# EAGLE design watering (EAGLE 6.1)
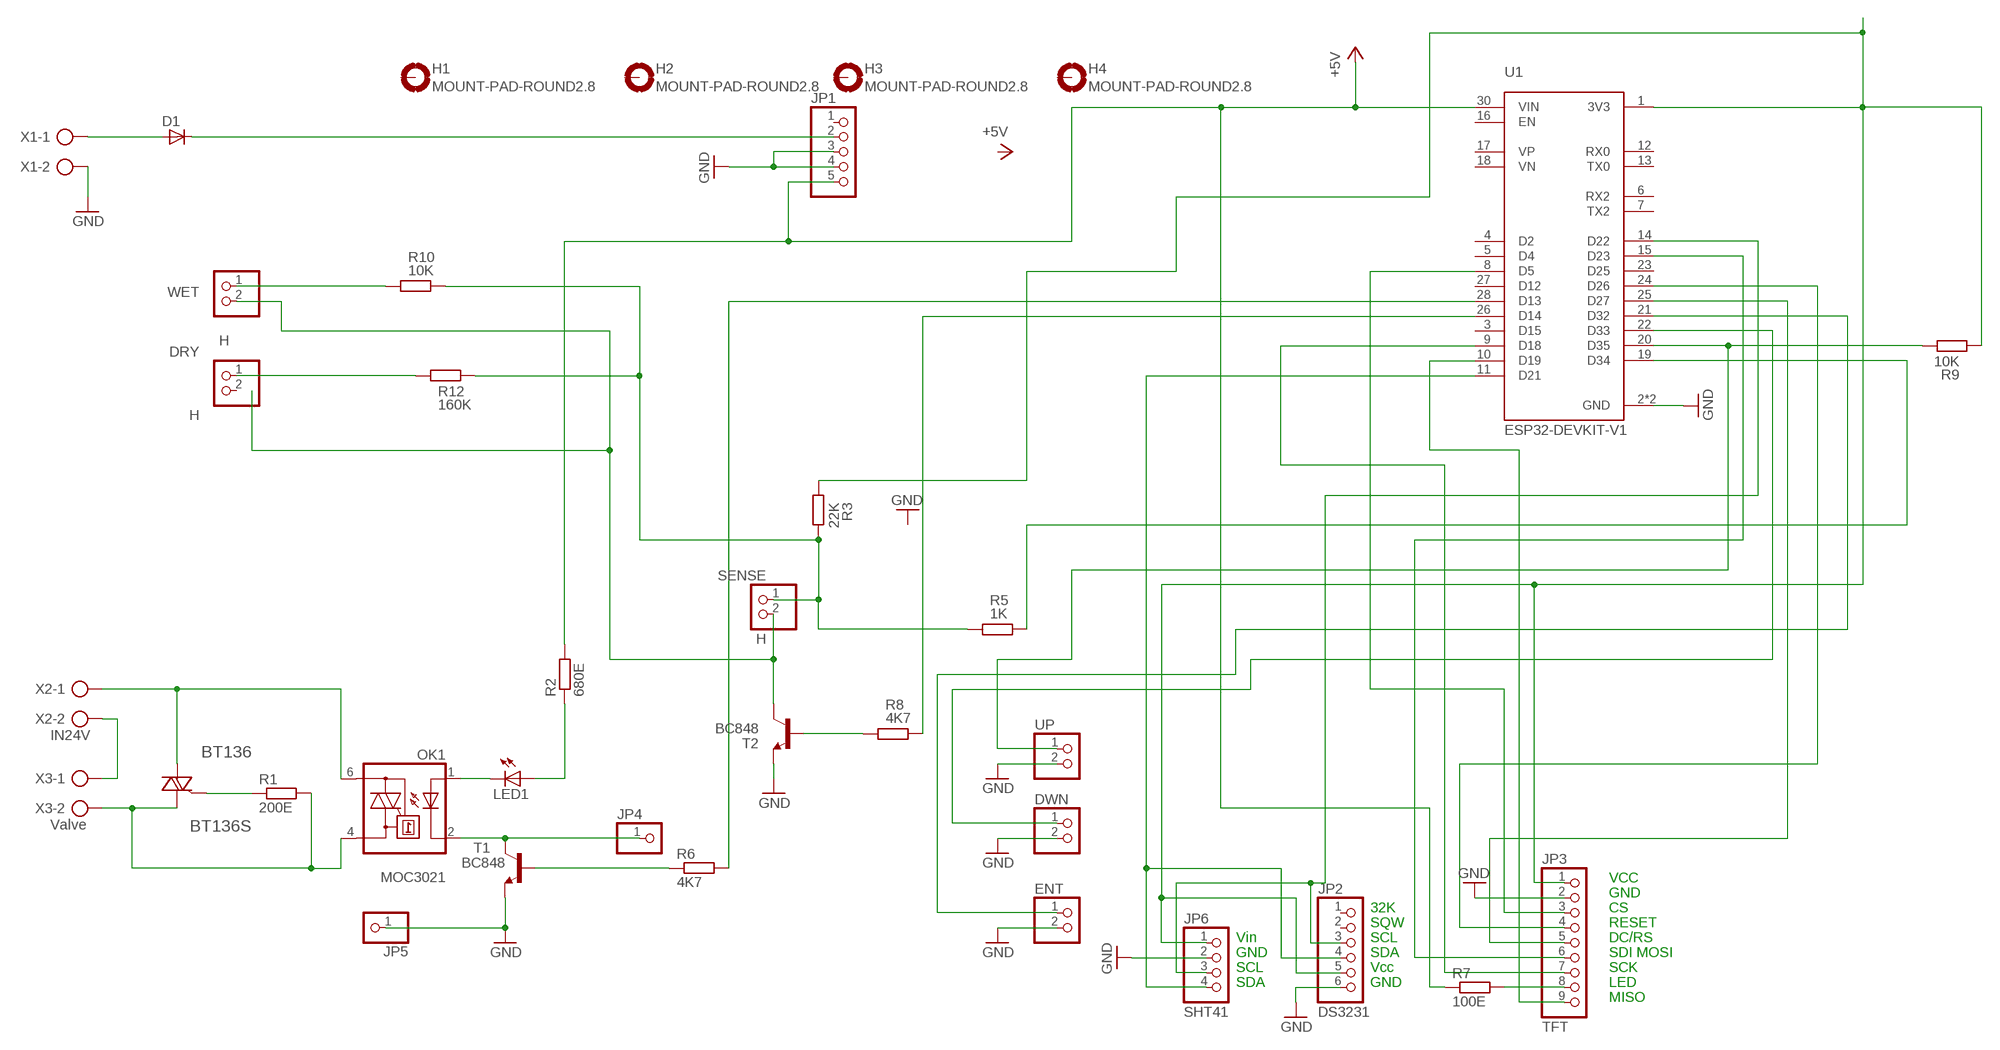
[diagram p0: schematic, sheet 1]

## Parts
BT136  BT136S  T435-600B  [DPAK228P987X240-3N]
D1  D-SOD-80  [SOD80]
DRY  H  PINHD-1X2  [1X02]
DWN  PINHD-1X2  [1X02]
ENT  PINHD-1X2  [1X02]
H1  MOUNT-PAD-ROUND2.8  [2,8-PAD]
H2  MOUNT-PAD-ROUND2.8  [2,8-PAD]
H3  MOUNT-PAD-ROUND2.8  [2,8-PAD]
H4  MOUNT-PAD-ROUND2.8  [2,8-PAD]
JP1  PINHD-1X5  [1X05]
JP2  DS3231  PINHD-1X6  [1X06]
JP3  TFT  PINHD-1X9  [1X09]
JP4  PINHD-1X1  [1X01]
JP5  PINHD-1X1  [1X01]
JP6  SHT41  PINHD-1X4  [1X04]
LED1  LEDCHIPLED_0805  [CHIPLED_0805]
OK1  MOC3021  MOC3031S  [DIL6-SMD]
R1  200E  R-EU_R0603  [R0603]
R2  680E  R-EU_R0603  [R0603]
R3  22K  R-EU_R0603  [R0603]
R5  1K  R-EU_R0603  [R0603]
R6  4K7  R-EU_R0603  [R0603]
R7  100E  R-EU_R0603  [R0603]
R8  4K7  R-EU_R0603  [R0603]
R9  10K  R-EU_R0603  [R0603]
R10  10K  R-EU_R0603  [R0603]
R12  160K  R-EU_R0603  [R0603]
SENSE  H  PINHD-1X2  [1X02]
T1  BC848  [SOT23]
T2  BC848  [SOT23]
U1  ESP32-DEVKIT-V1  [MODULE_ESP32_DEVKIT_V1]
UP  PINHD-1X2  [1X02]
WET  H  PINHD-1X2  [1X02]
X1  AK300/2  [AK300/2]
X2  IN24V  AK300/2  [AK300/2]
X3  Valve  AK300/2  [AK300/2]

## Nets
+5V: JP1.5 R2.2 R7.1 U1.30(VIN)
GND: DWN.2 ENT.2 JP1.3 JP1.4 JP2.6 JP3.2 JP5.1 JP6.2 T1.2(E) T2.2(E) U1.2(GND) U1.29(GND) UP.2 X1.2
N$1: X2.2 X3.1
N$2: BT136.1(A1) OK1.4(A1) R1.2 X3.2
N$3: BT136.3(A2) OK1.6(A2) X2.1
N$4: JP2.5 JP3.1 JP6.1 R3.1 R9.1 U1.1(3V3)
N$5: BT136.2(G) R1.1
N$6: LED1.A R2.1
N$7: JP4.1 OK1.2(C) T1.3(C)
N$8: LED1.C OK1.1(A)
N$9: D1.2(A) X1.1
N$10: D1.1(C) JP1.2
N$11: R3.2 R5.1 R10.2 R12.2 SENSE.1
N$12: DRY.1 R12.1
N$13: R6.1 T1.1(B)
N$14: JP3.8 R7.2
N$15: SENSE.2 T2.3(C) WET.2
N$16: R8.1 T2.1(B)
N$17: R10.1 WET.1
N$18: JP2.3 JP6.3 U1.14(D22)
N$19: JP2.4 JP6.4 U1.11(D21)
N$20: JP3.7 U1.9(D18)
N$21: R8.2 U1.26(D14)
N$22: JP3.6 U1.15(D23)
N$23: R9.2 U1.20(D35) UP.1
N$24: JP3.3 U1.8(D5)
N$25: JP3.5 U1.25(D27)
N$26: JP3.4 U1.24(D26)
N$27: JP3.9 U1.10(D19)
N$28: DWN.1 U1.22(D33)
N$29: ENT.1 U1.21(D32)
N$31: R6.2 U1.28(D13)
N$32: R5.2 U1.19(D34)
Unconnected: DRY.2 H1.B2,8(MOUNT) H2.B2,8(MOUNT) H3.B2,8(MOUNT) H4.B2,8(MOUNT) JP1.1 JP2.1 JP2.2 U1.3(D15) U1.4(D2) U1.5(D4) U1.6(RX2) U1.7(TX2) U1.12(RX0) U1.13(TX0) U1.16(EN) U1.17(VP) U1.18(VN) U1.23(D25) U1.27(D12)

## Notes on the sheet
- VCC
- GND
- 32K | CS
- SQW | RESET
- Vin | SCL | DC/RS
- GND | SDA | SDI MOSI
- SCL | Vcc | SCK
- SDA | GND | LED
- MISO

## Library data of the parts
BT136 = T435-600B:T435-600B: Check availability <https://pricing.snapeda.com/parts/T435-600B/STMicroelectronics/view-part?ref=eda>; AVAILABILITY: In Stock; CHECK_PRICES: https://www.snapeda.com/parts/T435-600B/STMicroelectronics/view-part/?ref=eda; DESCRIPTION: TRIAC Alternistor - Snubberless 600 V 4 A Surface Mount DPAK; MF: STMicroelectronics; MP: T435-600B; PACKAGE: DPAK STMicroelectronics; PRICE: None; SNAPEDA_LINK: https://www.snapeda.com/parts/T435-600B/STMicroelectronics/view-part/?ref=snap
D1 = semicon-smd-ipc:D-: DIODE unfilled
DRY DWN ENT SENSE UP WET = pinhead:PINHD-1X2: PIN HEADER
H1-H4 = holes:MOUNT-PAD-ROUND: MOUNTING PAD, round
JP1 = pinhead:PINHD-1X5: PIN HEADER
JP2 = pinhead:PINHD-1X6: PIN HEADER
JP3 = pinhead:PINHD-1X9: PIN HEADER
JP4 JP5 = pinhead:PINHD-1X1: PIN HEADER
JP6 = pinhead:PINHD-1X4: PIN HEADER
LED1 = led:LED: LED OSRAM: - CHIPLED LG R971, LG N971, LY N971, LG Q971, LY Q971, LO R971, LY R971 LH N974, LH R974 LS Q976, LO Q976, LY Q976 LO Q996 - Hyper CHIPLED LW Q18S LB Q993, LB Q99A, LB R99A - SideLED LS A670, LO A670, LY A670, LG A670, LP A670 LB A673, LV A673, LT A673, LW A673 LH A674 LY A675 LS A676, LA A676, LO A676, LY A676, LW A676 LS A679, LY A679, LG A679 - Hyper Micro SIDELED® LS Y876, LA Y876, LO Y876, LY Y876 LT Y87S - SmartLED LW L88C, LW L88S LB L89C, LB L89S, LG L890 LS L89K, LO L89K, LY L89K LS L896, LA L896, LO L896, LY L896 - TOPLED LS T670, LO T670, LY T670, LG T670, LP T670 LSG T670, LSP T670, LSY T670, LOP T670, LYG T670 LG T671, LOG T671, LSG T671 LB T673, LV T673, LT T673, LW T673 LH T674 LS T676, LA T676, LO T676, LY T676, LB T676, LH T676, LSB T676, LW T676 LB T67C, LV T67C, LT T67C, LS T67K, LO T67K, LY T67K, LW E67C LS E67B, LA E67B, LO E67B, LY E67B, LB E67C, LV E67C, LT E67C LW T67C LS T679, LY T679, LG T679 LS T770, LO T770, LY T770, LG T770, LP T770 LB T773, LV T773, LT T773, LW T773 LH T774 LS E675, LA E675, LY E675, LS T675 LS T776, LA T776, LO T776, LY T776, LB T776 LHGB T686 LT T68C, LB T68C - Hyper Mini TOPLED® LB M676 - Mini TOPLED Santana® LG M470 LS M47K, LO M47K, LY M47K Source: http://www.osram.convergy.de LUXEON: - LUMILED® LXK2-PW12-R00, LXK2-PW12-S00, LXK2-PW14-U00, LXK2-PW14-V00 LXK2-PM12-R00, LXK2-PM12-S00, LXK2-PM14-U00 LXK2-PE12-Q00, LXK2-PE12-R00, LXK2-PE12-S00, LXK2-PE14-T00, LXK2-PE14-U00 LXK2-PB12-K00, LXK2-PB12-L00, LXK2-PB12-M00, LXK2-PB14-N00, LXK2-PB14-P00, LXK2-PB14-Q00 LXK2-PR12-L00, LXK2-PR12-M00, LXK2-PR14-Q00, LXK2-PR14-R00 LXK2-PD12-Q00, LXK2-PD12-R00, LXK2-PD12-S00 LXK2-PH12-R00, LXK2-PH12-S00 LXK2-PL12-P00, LXK2-PL12-Q00, LXK2-PL12-R00 Source: www.luxeon.com KINGBRIGHT: KA-3528ASYC Source: www.kingbright.com
OK1 = optocoupler:MOC30*: 6-Pin DIP Zero-Cross Optoisolators Triac Driver Output (250/400 Volt Peak) Source: http://www.fairchildsemi.com/ds/MO/MOC3043-M.pdf; MF: FAIRCHILD SEMICONDUCTOR; MPN: MOC3031SM; OC_FARNELL: unknown; OC_NEWARK: 34C1335
R1-R3 R5-R10 R12 = rcl:R-EU_: RESISTOR, European symbol
T1 T2 = transistor:BC848: NPN TRANSISTOR
U1 = ESP32-DEVKIT-V1:ESP32-DEVKIT-V1: Check availability <https://pricing.snapeda.com/parts/ESP32-DEVKIT-V1/Do%20it/view-part?ref=eda>; AVAILABILITY: Not in stock; CHECK_PRICES: https://www.snapeda.com/parts/ESP32-DEVKIT-V1/Do+it/view-part/?ref=eda; DESCRIPTION: Dual core, Wi-Fi: 2.4 GHz up to 150 Mbits/s,BLE (Bluetooth Low Energy) and legacy Bluetooth, 32 bits, Up to 240 MHz; MF: Do it; MP: ESP32-DEVKIT-V1; PACKAGE: None; PRICE: None; SNAPEDA_LINK: https://www.snapeda.com/parts/ESP32-DEVKIT-V1/Do+it/view-part/?ref=snap
X1-X3 = con-ptr500:AK300/2: CONNECTOR; OC_FARNELL: unknown; OC_NEWARK: unknown

## Board
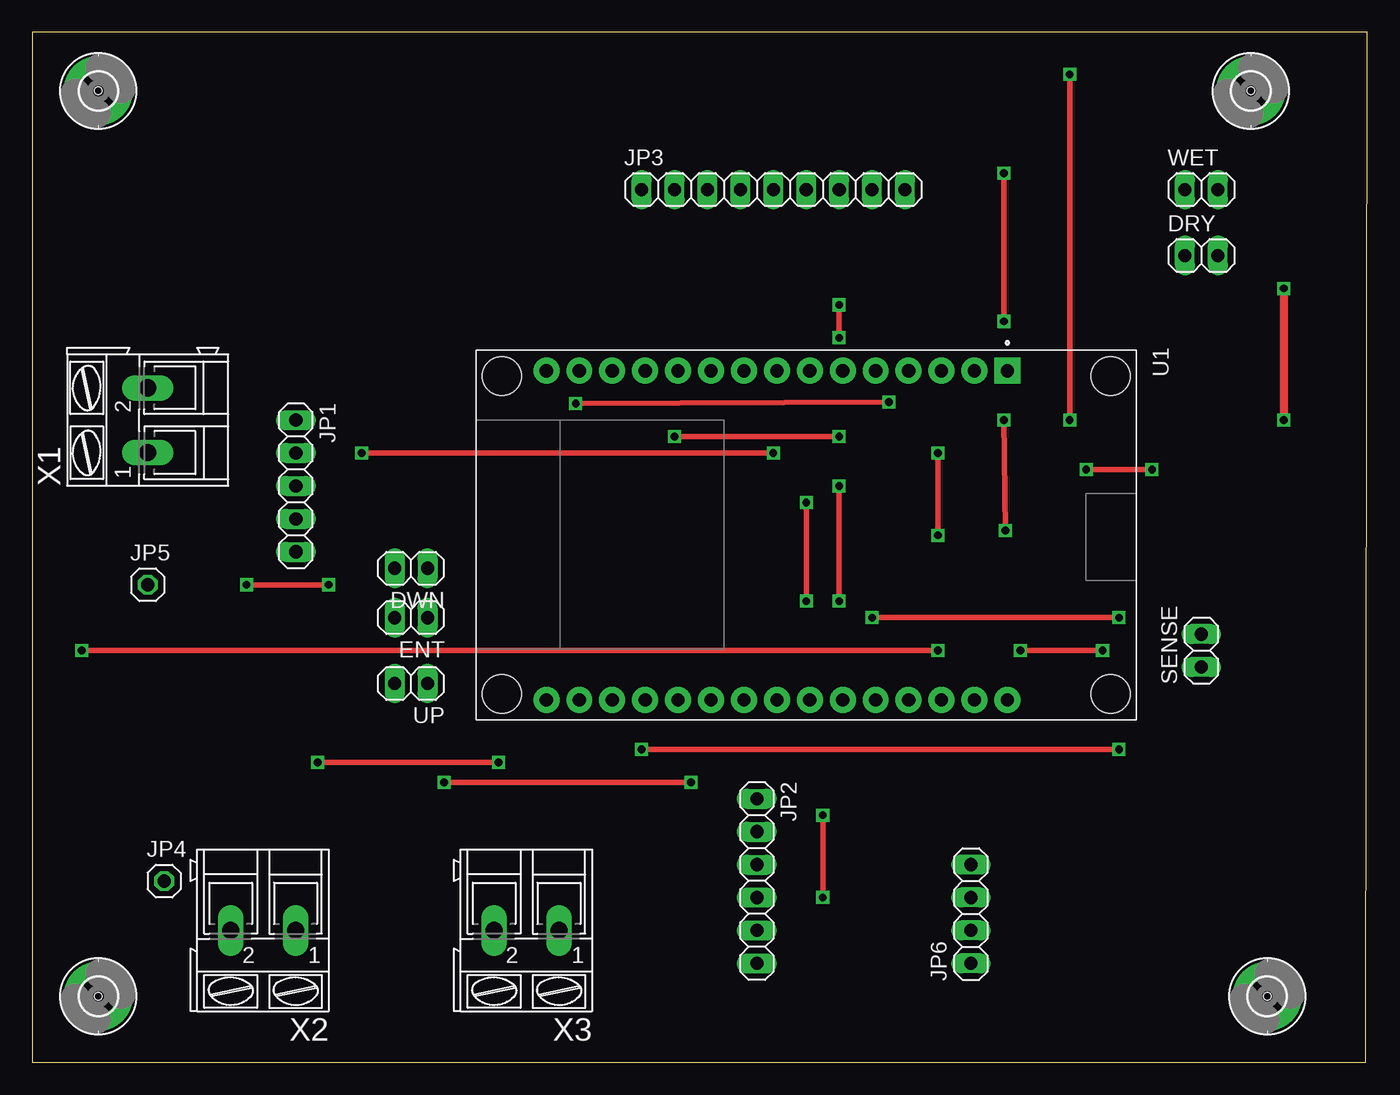
[diagram p1: board, top side]
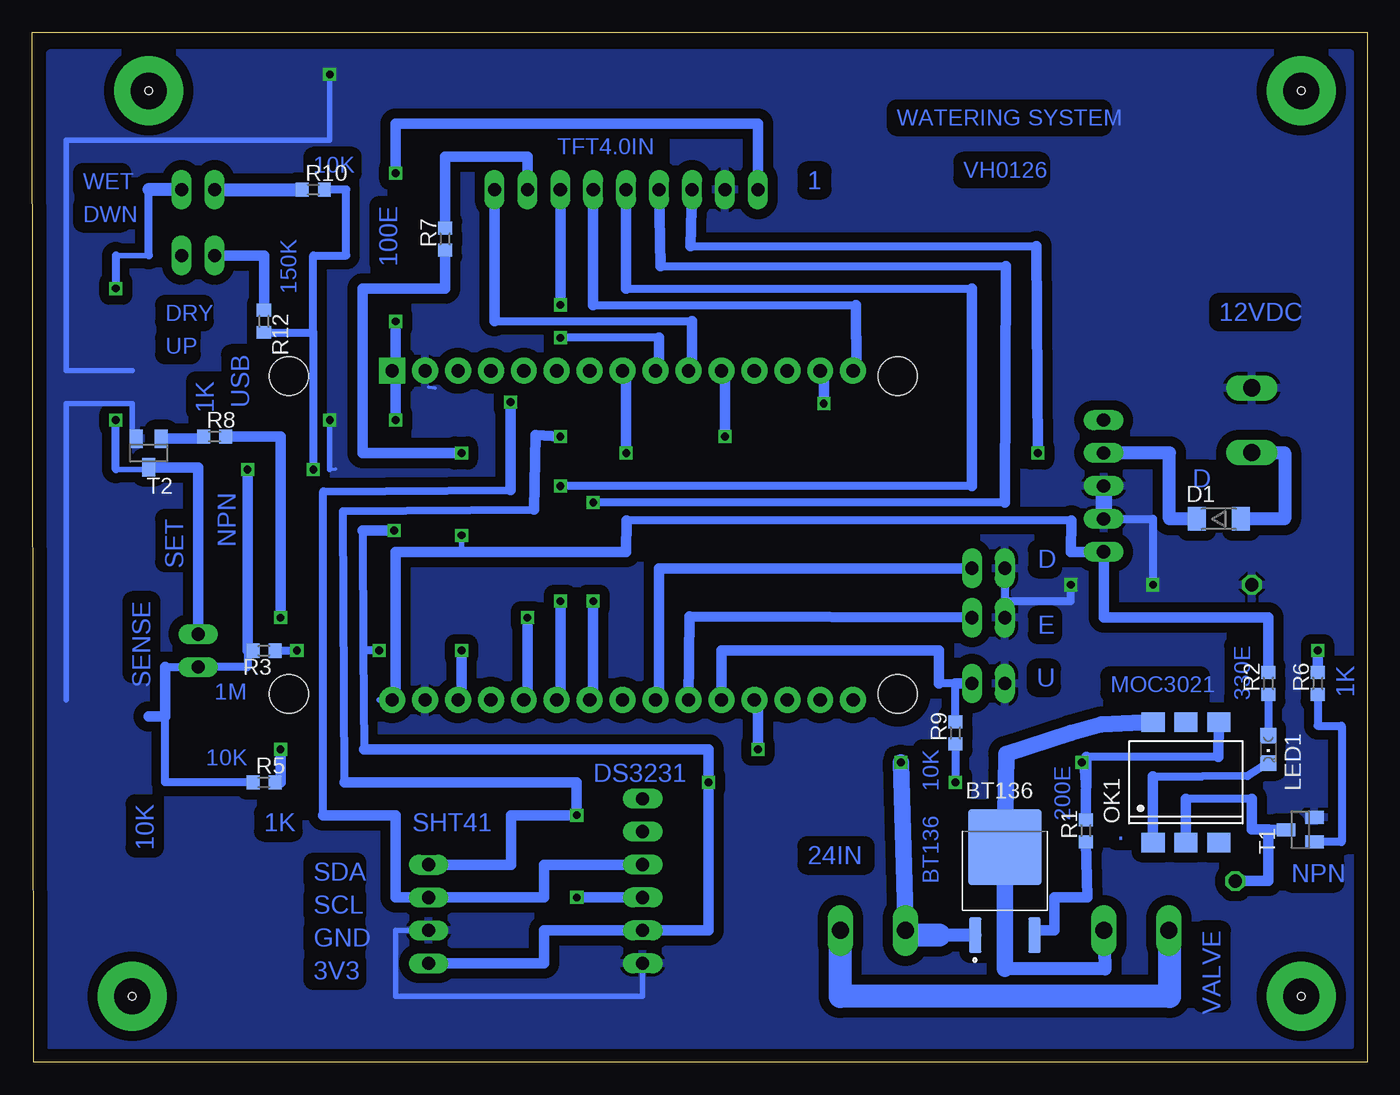
[diagram p2: board, bottom side, seen from below]

Size 102.95 x 79.44 mm. Coordinates in mm from the lower left corner, seen from the top.
Outline: 0,0 102.85,0 102.95,79.44 0,79.44 0,0
Copper layers (1*16): Top 0.035mm / dielectric 1.5mm / Bottom 0.035mm
Design rules: minimum track width 10mil, minimum drill 24mil, track to track 30mil, track to pad 35mil, pad to pad 8mil, via to via 8mil, smd to smd 8mil, copper to edge 40mil, drill to drill 8mil, minimum pad ring 10mil, minimum via ring 8mil, stop-mask expansion 4mil, vias tented up to drill 0mil, thermal gap 10mil
Holes 0.6 mm at 5.08,74.93 5.08,5.08 95.25,5.08 93.98,74.93

### Footprints (pad centres in the part's own frame; a part is rotated, then mirrored left to right if it is on the bottom)
DPAK228P987X240-3N = smd 0.98 x 2.74: 1 -2.286,-4.18; 2 2.286,-4.18 | smd 5.63 x 5.86: 3 0,2.62
SOD80 = smd 1.4 x 1.8: 1 -1.7,0; 2 1.7,0
1X02 = drill 1.016 long: 1 -1.27,0; 2 1.27,0
2,8-PAD = drill 2.8 pad 5.334: B2,8 0,0
1X05 = drill 1.016 long: 1 -5.08,0; 2 -2.54,0; 3 0,0; 4 2.54,0; 5 5.08,0
1X06 = drill 1.016 long: 1 -6.35,0; 2 -3.81,0; 3 -1.27,0; 4 1.27,0; 5 3.81,0; 6 6.35,0
1X09 = drill 1.016 long: 1 -10.16,0; 2 -7.62,0; 3 -5.08,0; 4 -2.54,0; 5 0,0; 6 2.54,0; 7 5.08,0; 8 7.62,0; 9 10.16,0
1X01 = drill 1.016 octagon: 1 0,0
1X04 = drill 1.016 long: 1 -3.81,0; 2 -1.27,0; 3 1.27,0; 4 3.81,0
CHIPLED_0805 = smd 1.2 x 1.2: A 0,-1.05; C 0,1.05
DIL6-SMD = smd 1.78 x 1.52: 1 -2.54,-4.645; 2 0,-4.645; 3 2.54,-4.645; 4 2.54,4.645; 5 0,4.645; 6 -2.54,4.645
R0603 = smd 1 x 1.1: 1 -0.85,0; 2 0.85,0
SOT23 = smd 1 x 1.4: 1 -0.95,-1.1; 2 0.95,-1.1; 3 0,1.1
MODULE_ESP32_DEVKIT_V1 = drill 1.02 pad 2 square: 1 -12.7,15.515 | drill 1.02 pad 2: 2 -12.7,12.975; 3 -12.7,10.435; 4 -12.7,7.895; 5 -12.7,5.355; 6 -12.7,2.815; 7 -12.7,0.275; 8 -12.7,-2.265; 9 -12.7,-4.805; 10 -12.7,-7.345; 11 -12.7,-9.885; 12 -12.7,-12.425; 13 -12.7,-14.965; 14 -12.7,-17.505; 15 -12.7,-20.045; 16 12.7,-20.045; 17 12.7,-17.505; 18 12.7,-14.965; 19 12.7,-12.425; 20 12.7,-9.885; 21 12.7,-7.345; 22 12.7,-4.805; 23 12.7,-2.265; 24 12.7,0.275; 25 12.7,2.815; 26 12.7,5.355; 27 12.7,7.895; 28 12.7,10.435; 29 12.7,12.975; 30 12.7,15.515 | hole 3: -12.28,-23.475; 12.23,-23.475; 12.23,23.475; -12.28,23.475
AK300/2 = drill 1.321 long: 1 -2.515,0; 2 2.489,0

### Placement (x,y rotation side)
BT136  27.94,13.97 0 bottom
D1  11.43,41.91 0 bottom
DRY  90.17,62.23 0 top
DWN  29.21,38.1 180 top
ENT  29.21,34.29 180 top
H1  5.08,5.08 0 top
H2  5.08,74.93 0 top
H3  93.98,74.93 0 top
H4  95.25,5.08 0 top
JP1  20.32,44.45 270 top
JP2  55.88,13.97 270 top
JP3  57.15,67.31 0 top
JP4  10.16,13.97 0 top
JP5  8.89,36.83 0 top
JP6  72.39,11.43 90 top
LED1  7.62,24.13 180 bottom
OK1  13.97,21.59 0 bottom
R1  21.69,17.86 90 bottom
R2  7.62,29.21 90 bottom
R3  85.09,31.75 180 bottom
R5  85.09,21.59 0 bottom
R6  3.81,29.21 90 bottom
R7  71.12,63.5 90 bottom
R8  88.9,48.26 0 bottom
R9  31.75,25.4 90 bottom
R10  81.28,67.31 0 bottom
R12  85.09,57.15 270 bottom
SENSE  90.17,31.75 90 top
T1  5.15,17.93 90 bottom
T2  93.98,46.99 180 bottom
U1  59.69,40.64 270 top
UP  29.21,29.21 180 top
WET  90.17,67.31 0 top
X1  8.89,49.53 90 top
X2  17.78,10.16 180 top
X3  38.1,10.16 180 top

### Tracks (layer width: path | path; a pad name or v marks a point on that pad's centre or on a via)
+5V  (via drill 0.6)
  Top 0.406: v69.85,46.99 v69.85,40.64
  Bottom 0.254: 74.93,27.94 U1.30
  Bottom 0.406: U1.30 76.2,27.94 | 69.85,39.37 v69.85,40.64
  Bottom 0.61: 22.82,41.79 57.11,41.79
  Bottom 0.813: 74.93,27.94 74.93,39.37 69.85,39.37 57.15,39.37 57.11,41.79 | R7.1 71.12,59.69 77.47,59.69 77.47,46.99 v69.85,46.99 | R2.2 7.62,34.29 20.32,34.29 JP1.5 22.86,39.37 22.82,41.79
GND  (via drill 0.6)
  Top 0.406: v16.51,36.83 v22.86,36.83 | v80.01,49.53 v80.01,76.2
  Bottom 0.254: 72.79,53.34 U1.2 72.39,53.34 | 80.01,45.72 79.57,45.74 | 72.39,52.07 71.88,51.99 | JP1.4 | ENT.2
  Bottom 0.406: JP2.6 55.88,5.08 74.93,5.08 74.93,10.16 JP6.2 | T2.2 95.25,48.09 95.25,50.8 100.33,50.8 100.33,27.94 | 95.25,53.34 100.33,53.34 100.33,71.12 80.01,71.12 v80.01,76.2 | 80.01,45.72 v80.01,49.53
  Bottom 0.61: DWN.2 27.94,35.56 22.86,35.56 v22.86,36.83 | JP1.4 16.51,41.91 v16.51,36.83
  Bottom 1.27: JP1.3 JP1.4
  pour Bottom: 1.27,1.27 1.27,77.82 101.6,77.82 101.6,1.27
N$1
  Bottom 0.254: 40.64,10.16 X3.1
  Bottom 0.406: X2.2 15.24,10.16
  Bottom 1.778: 15.24,10.16 15.24,5.08 40.64,5.08 40.64,10.16
N$2  (via drill 0.6)
  Top 0.406: v21.99,23.12 v35.96,23.12
  Bottom 0.406: 35.61,9.79 X3.2 | BT136.1 35.56,9.79 | R1.2 v21.99,23.12
  Bottom 0.61: 11.48,23.54 21.64,23.54
  Bottom 0.813: OK1.4 11.48,23.54 | 21.64,23.54 R1.2
  Bottom 1.016: BT136.1 33.02,9.79
  Bottom 1.27: 35.56,9.79 v35.96,23.12
  Bottom 1.778: 33.02,9.79 35.61,9.79
N$3
  Bottom 0.406: X2.1 20.32,10.16 | 27.85,7.19 27.94,7.19 | BT136.3 27.94,16.51
  Bottom 1.016: 20.32,10.16 20.23,7.19 27.85,7.19
  Bottom 1.27: OK1.6 20.51,26.05 22.86,25.4 27.84,23.79 BT136.3 27.94,7.19
N$4  (via drill 0.6)
  Top 0.406: v74.93,68.58 v74.93,57.15 | v74.93,49.53 v75.04,41.01 | v31.75,21.59 v50.8,21.59 | v76.2,31.75 v82.55,31.75
  Bottom 0.406: U1.1 74.93,53.34 | 76.2,31.78 v76.2,31.75
  Bottom 0.61: 77.49,41.01 77.43,31.78 | 77.43,31.78 77.38,24.13 | R9.1 v31.75,21.59 | R3.1 v82.55,31.75 | 77.43,31.78 76.2,31.78
  Bottom 0.813: JP6.1 63.5,7.62 63.5,10.16 JP2.5 50.8,10.16 v50.8,21.59 50.8,24.13 77.38,24.13 | v75.04,41.01 77.49,41.01 | JP3.1 46.99,72.39 74.93,72.39 v74.93,68.58 | v74.93,57.15 74.93,53.34 v74.93,49.53
N$5
  Bottom 0.813: R1.1 21.59,12.7 24.13,12.7 24.13,10.16 25.65,10.16 BT136.2
N$6
  Bottom 0.61: R2.1 LED1.A
N$7
  Bottom 0.406: 7.45,15.24 7.62,15.24
  Bottom 0.61: 8.89,20.32 13.97,20.32
  Bottom 0.813: OK1.2 13.97,20.32 | JP4.1 7.62,13.97 7.62,15.24 7.62,17.95 | T1.3 7.62,17.95 | 7.62,17.95 8.89,17.95 8.89,20.32
N$8
  Bottom 0.61: 16.51,22.03 12.75,22.03 9.22,22.07 LED1.C
  Bottom 0.813: OK1.1 16.51,22.03
N$9
  Bottom 1.016: X1.1 6.35,47.02 6.35,41.91 D1.2
N$10
  Bottom 1.016: D1.1 15.24,41.91 15.24,46.99 JP1.2
N$11  (via drill 0.6)
  Top 0.406: v81.28,45.72 v86.36,45.72
  Bottom 0.406: R3.2 86.36,31.75
  Bottom 0.61: 86.36,31.75 86.36,30.48 SENSE.1 92.71,30.48 | R5.1 92.71,21.59 92.71,26.67 | 81.28,56.3 81.28,62.23 78.74,62.23 78.74,67.31 R10.2 | R12.2 81.28,56.3 | 81.28,56.3 v81.28,45.72
  Bottom 0.813: 86.36,31.75 v86.36,45.72 | 93.98,26.67 92.71,26.67 92.71,30.48
N$12
  Bottom 0.813: DRY.1 85.09,62.23 R12.1
N$13
  Bottom 0.406: R6.1 | T1.1
  Bottom 0.61: R6.1 3.8,25.95 1.96,25.95 1.96,16.98 T1.1
N$14
  Bottom 0.813: JP3.8 64.77,69.85 71.12,69.85 R7.2
N$15  (via drill 0.6)
  Top 0.61: v96.52,59.69 v96.52,49.53
  Bottom 0.406: 96.52,45.72 93.98,45.72 T2.3 | 96.52,62.23 93.98,62.23
  Bottom 0.61: 93.98,62.23 93.98,67.31 | 96.52,45.72 v96.52,49.53 | 96.52,62.23 v96.52,59.69
  Bottom 0.813: T2.3 90.17,45.89 SENSE.2
  Bottom 1.016: WET.2 93.98,67.31
N$16
  Bottom 0.406: R8.1 90.17,48.26 90.17,48.09
  Bottom 0.813: T2.1 90.17,48.09
N$17
  Bottom 1.016: WET.1 R10.1
N$18  (via drill 0.6)
  Top 0.406: v41.91,50.8 v66.08,50.91
  Bottom 0.406: U1.14 41.91,53.34
  Bottom 0.61: 80.52,19.05 80.52,44.02 66.08,44.14
  Bottom 0.813: JP2.3 63.5,15.24 63.5,12.7 JP6.3 74.93,12.7 74.93,19.05 80.52,19.05 | 66.08,44.14 v66.08,50.91 | 41.91,53.34 v41.91,50.8
N$19  (via drill 0.6)
  Top 0.406: v60.96,19.05 v60.96,12.7 | v49.53,48.26 v62.23,48.26
  Bottom 0.406: U1.11 49.53,53.34
  Bottom 0.61: 78.88,21.59 78.99,42.51 64.25,42.62
  Bottom 0.813: JP2.4 v60.96,12.7 | JP6.4 66.04,15.24 66.04,19.05 v60.96,19.05 60.96,21.59 78.88,21.59 | 64.25,42.62 64.14,48.37 v62.23,48.26 | 49.53,53.34 v49.53,48.26
N$20  (via drill 0.6)
  Top 0.406: v62.23,58.42 v62.23,55.88
  Bottom 0.406: U1.9 54.61,53.34
  Bottom 0.61: 54.61,55.88 v62.23,55.88
  Bottom 0.813: JP3.7 v62.23,58.42 | 54.61,53.34 54.61,55.88
N$21  (via drill 0.6)
  Top 0.406: v83.82,34.29 v64.77,34.29
  Bottom 0.406: U1.26 64.77,27.94
  Bottom 0.813: R8.2 83.82,48.26 v83.82,34.29 | 64.77,27.94 v64.77,34.29
N$22
  Bottom 0.406: 39.37,53.34 U1.15
  Bottom 0.61: 59.69,58.42 39.42,58.42
  Bottom 0.813: JP3.6 59.69,58.42 | 39.42,58.42 39.42,55.88 39.37,55.88 39.37,53.34
N$23
  Bottom 0.61: 33.02,29.21 31.75,29.21 R9.2
  Bottom 0.813: UP.1 31.75,29.21 | 33.02,29.21 33.02,31.75 49.8,31.75 U1.20
N$24  (via drill 0.6)
  Top 0.406: v57.15,46.99 v25.4,46.99
  Bottom 0.406: U1.8 57.15,53.34
  Bottom 0.61: 52.18,62.94 25.51,62.94
  Bottom 0.813: JP3.3 52.18,62.94 | 57.15,53.34 v57.15,46.99 | 25.51,62.94 v25.4,46.99
N$25  (via drill 0.6)
  Top 0.406: v62.23,44.45 v62.23,35.56
  Bottom 0.406: U1.25 62.23,27.94
  Bottom 0.61: 57.15,59.69 30.48,59.69 | 30.48,44.45 v62.23,44.45
  Bottom 0.813: JP3.5 57.15,59.69 | 30.48,59.69 30.48,44.45 | 62.23,27.94 v62.23,35.56
N$26  (via drill 0.6)
  Top 0.406: v59.69,43.18 v59.69,35.56
  Bottom 0.406: U1.24 59.69,27.94
  Bottom 0.61: 54.52,61.39 27.85,61.39 | 27.94,43.18 v59.69,43.18
  Bottom 0.813: JP3.4 54.52,61.39 | 27.85,61.39 27.94,43.18 | 59.69,27.94 v59.69,35.56
N$27
  Bottom 0.254: 52.07,53.34 U1.10
  Bottom 0.61: 67.31,57.15 52.07,57.15
  Bottom 0.813: JP3.9 67.31,57.15 | 52.07,57.15 52.07,53.34
N$28
  Bottom 0.406: U1.22 54.61,27.94
  Bottom 0.813: DWN.1 54.61,38.1 54.61,27.94
N$29
  Bottom 0.813: ENT.1 52.25,34.38 U1.21
N$31  (via drill 0.6)
  Top 0.406: v3.81,31.75 v69.85,31.75
  Bottom 0.406: U1.28 69.85,27.94
  Bottom 0.813: 69.85,27.94 v69.85,31.75 | R6.2 v3.81,31.75
N$32  (via drill 0.6)
  Top 0.406: v83.82,24.13 v46.99,24.13
  Bottom 0.406: R5.2 83.82,21.59
  Bottom 0.813: 83.82,21.59 v83.82,24.13 | U1.19 46.99,27.94 v46.99,24.13

### Text on the board
Bottom: WATERING SYSTEM | TFT4.0IN | VH0126 | 10K | 1 | WET | 100E | DWN | 150K | 12VDC | DRY | USB | UP | 1K | D | NPN | SET | D | SENSE | E | 330E | 1K | U | MOC3021 | 1M | 10K | 10K | 200E | DS3231 | 10K | BT136 | . | SHT41 | 1K | 24IN | NPN | SDA | SCL | VALVE | GND | 3V3